# EAGLE board MIDI Decoder v1.0.0 (EAGLE 9.6.2), part 1 of 3
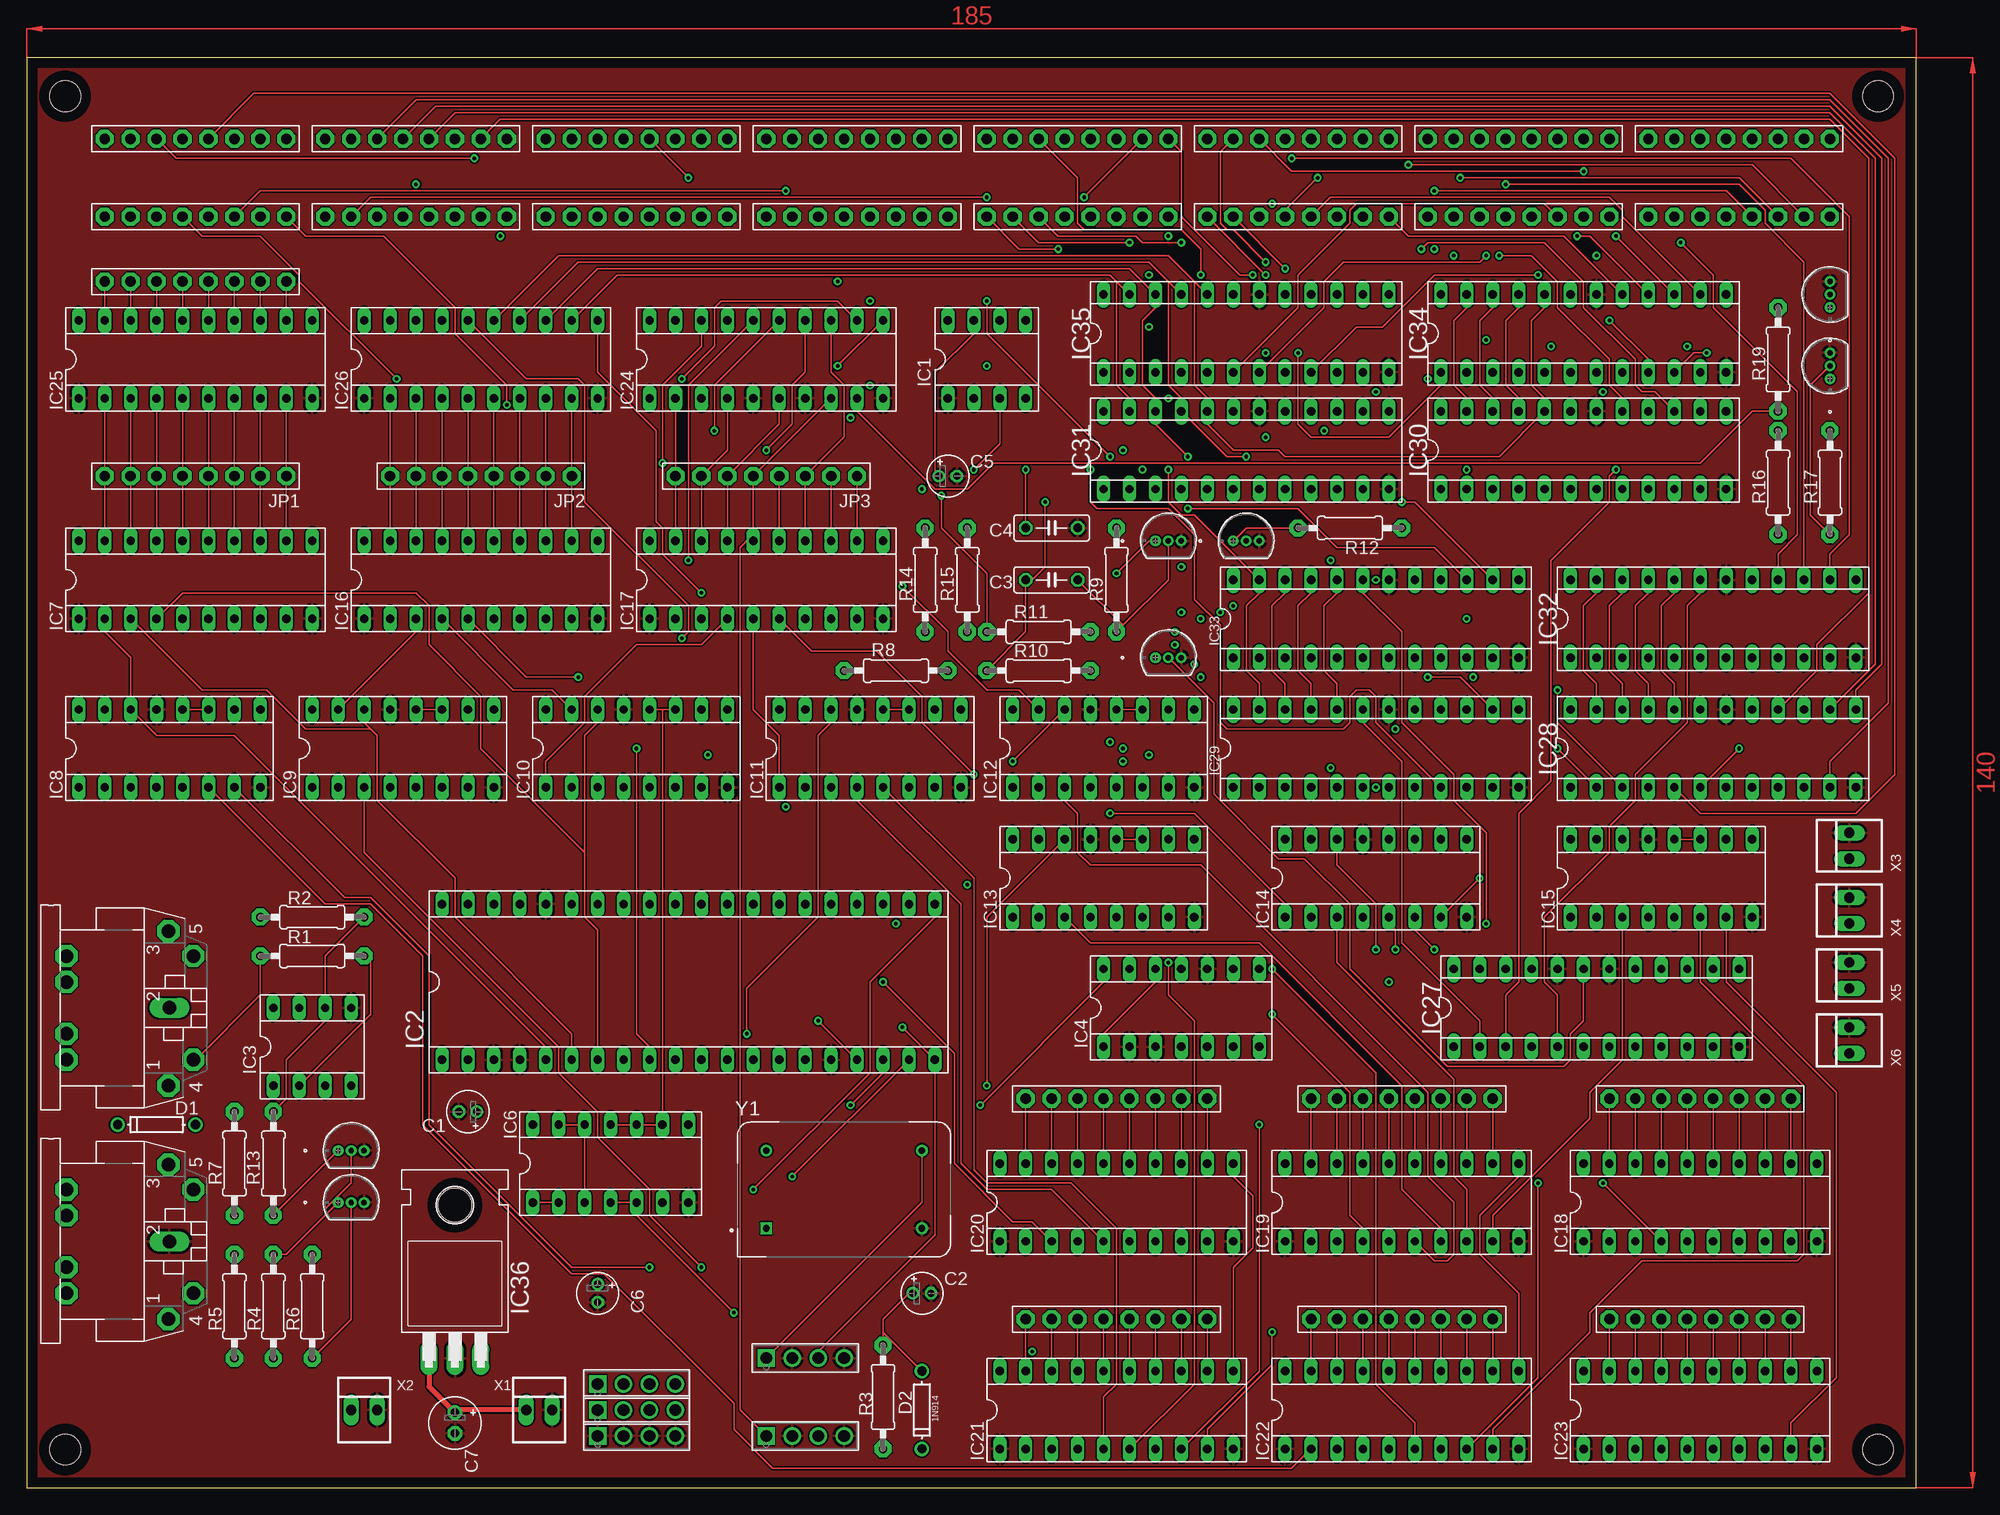
[diagram p2: board, top side]
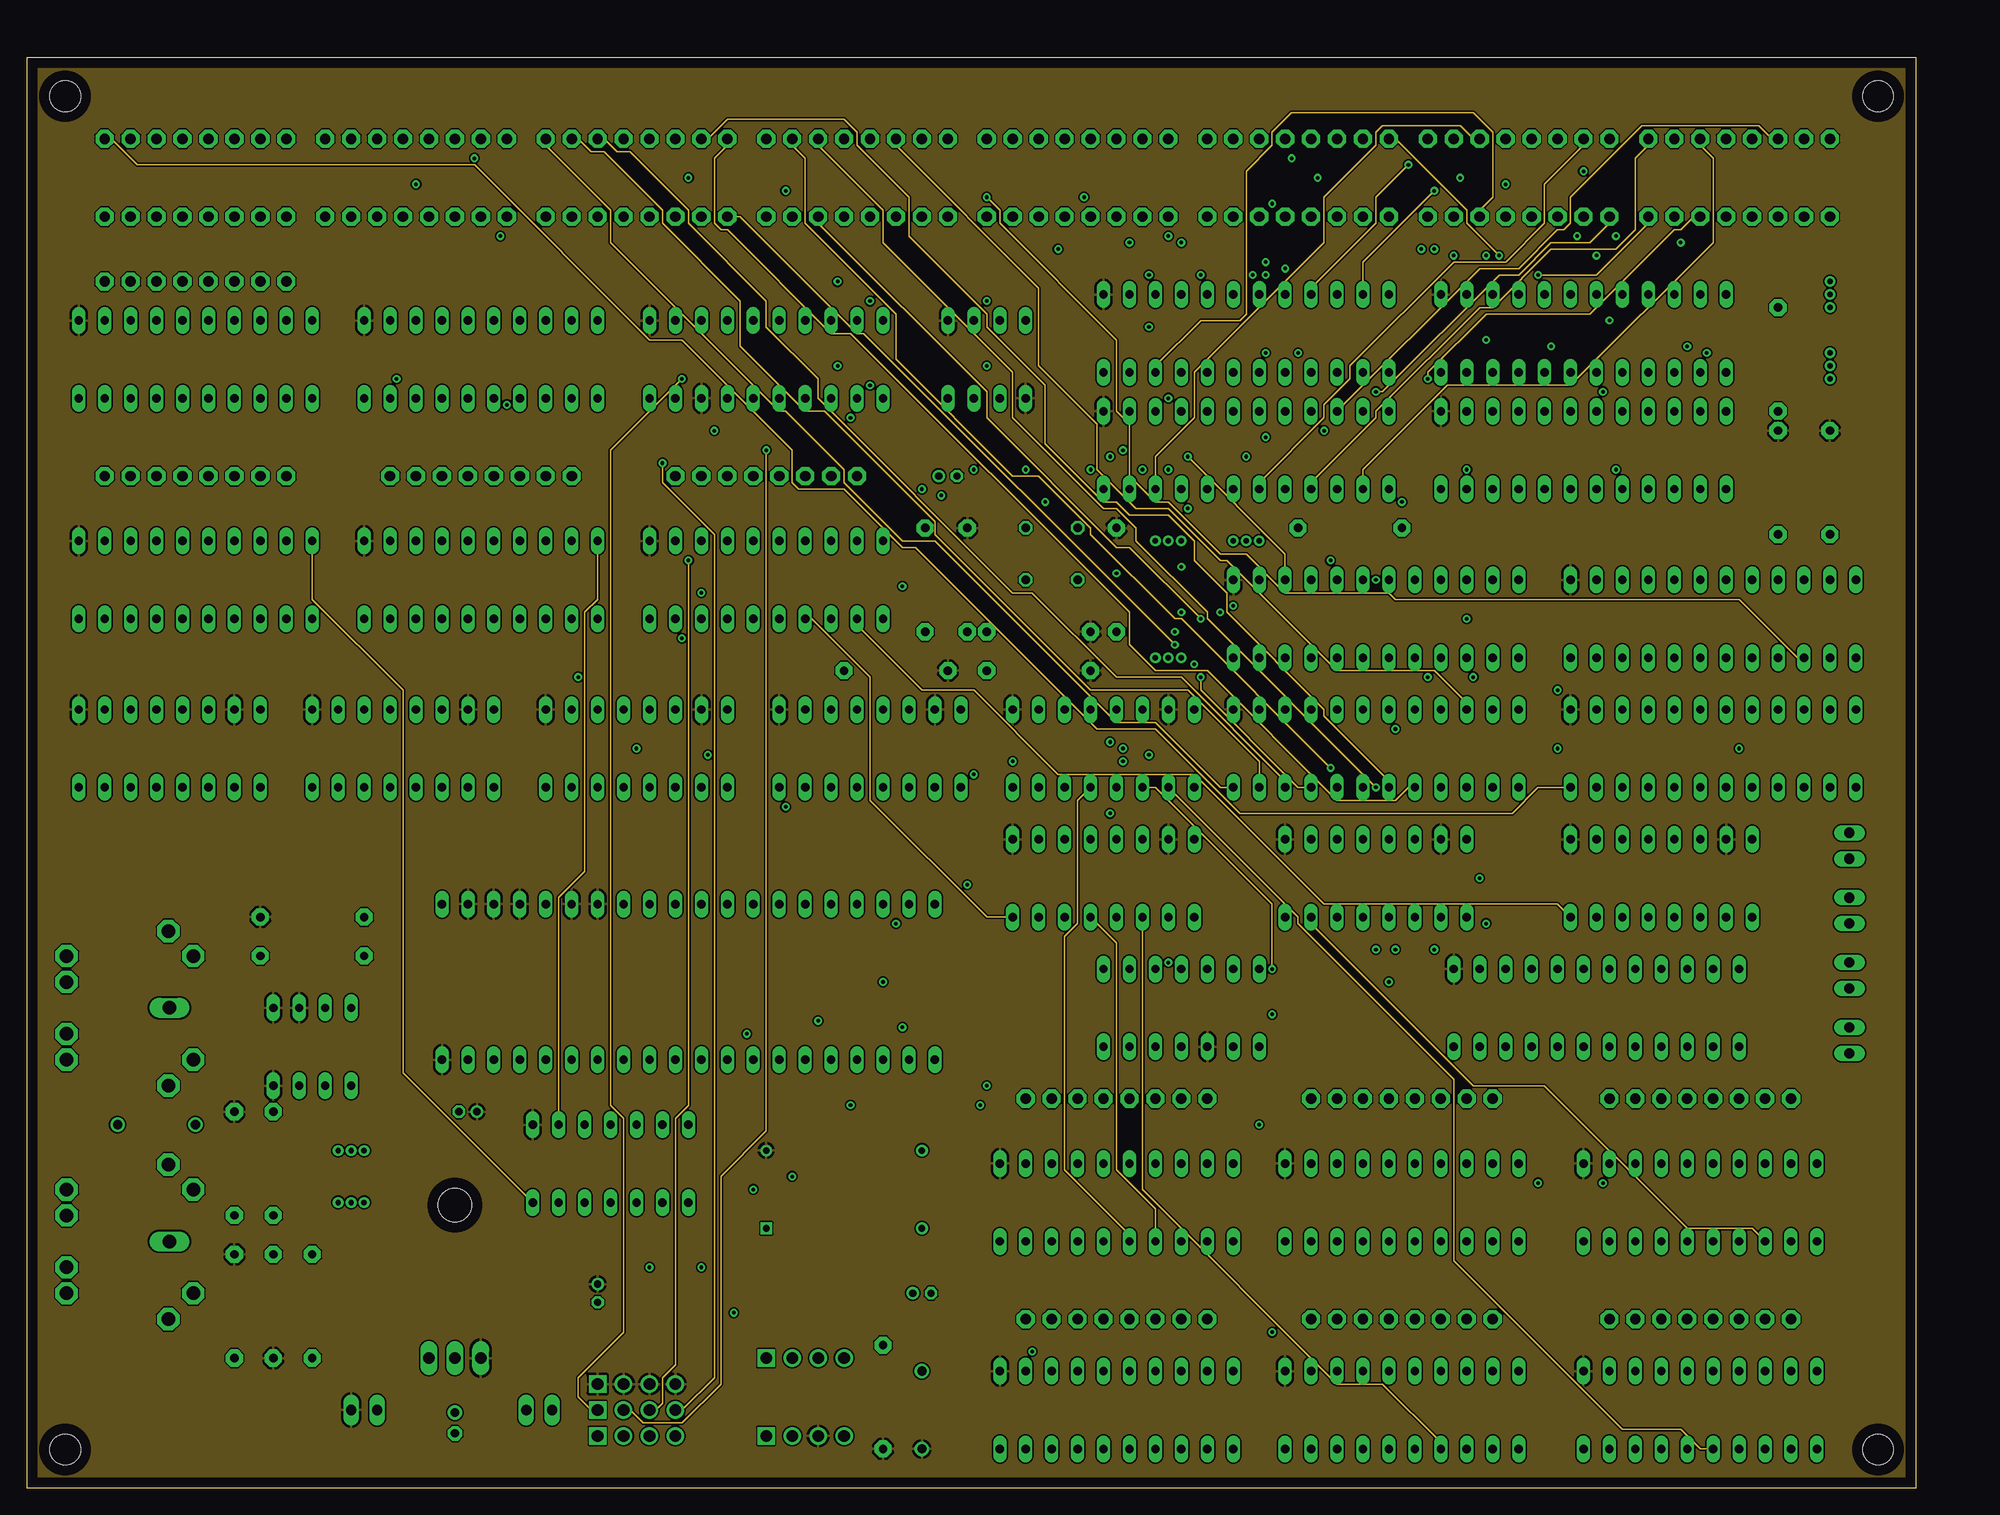
[diagram p3: board, inner layer Route2]
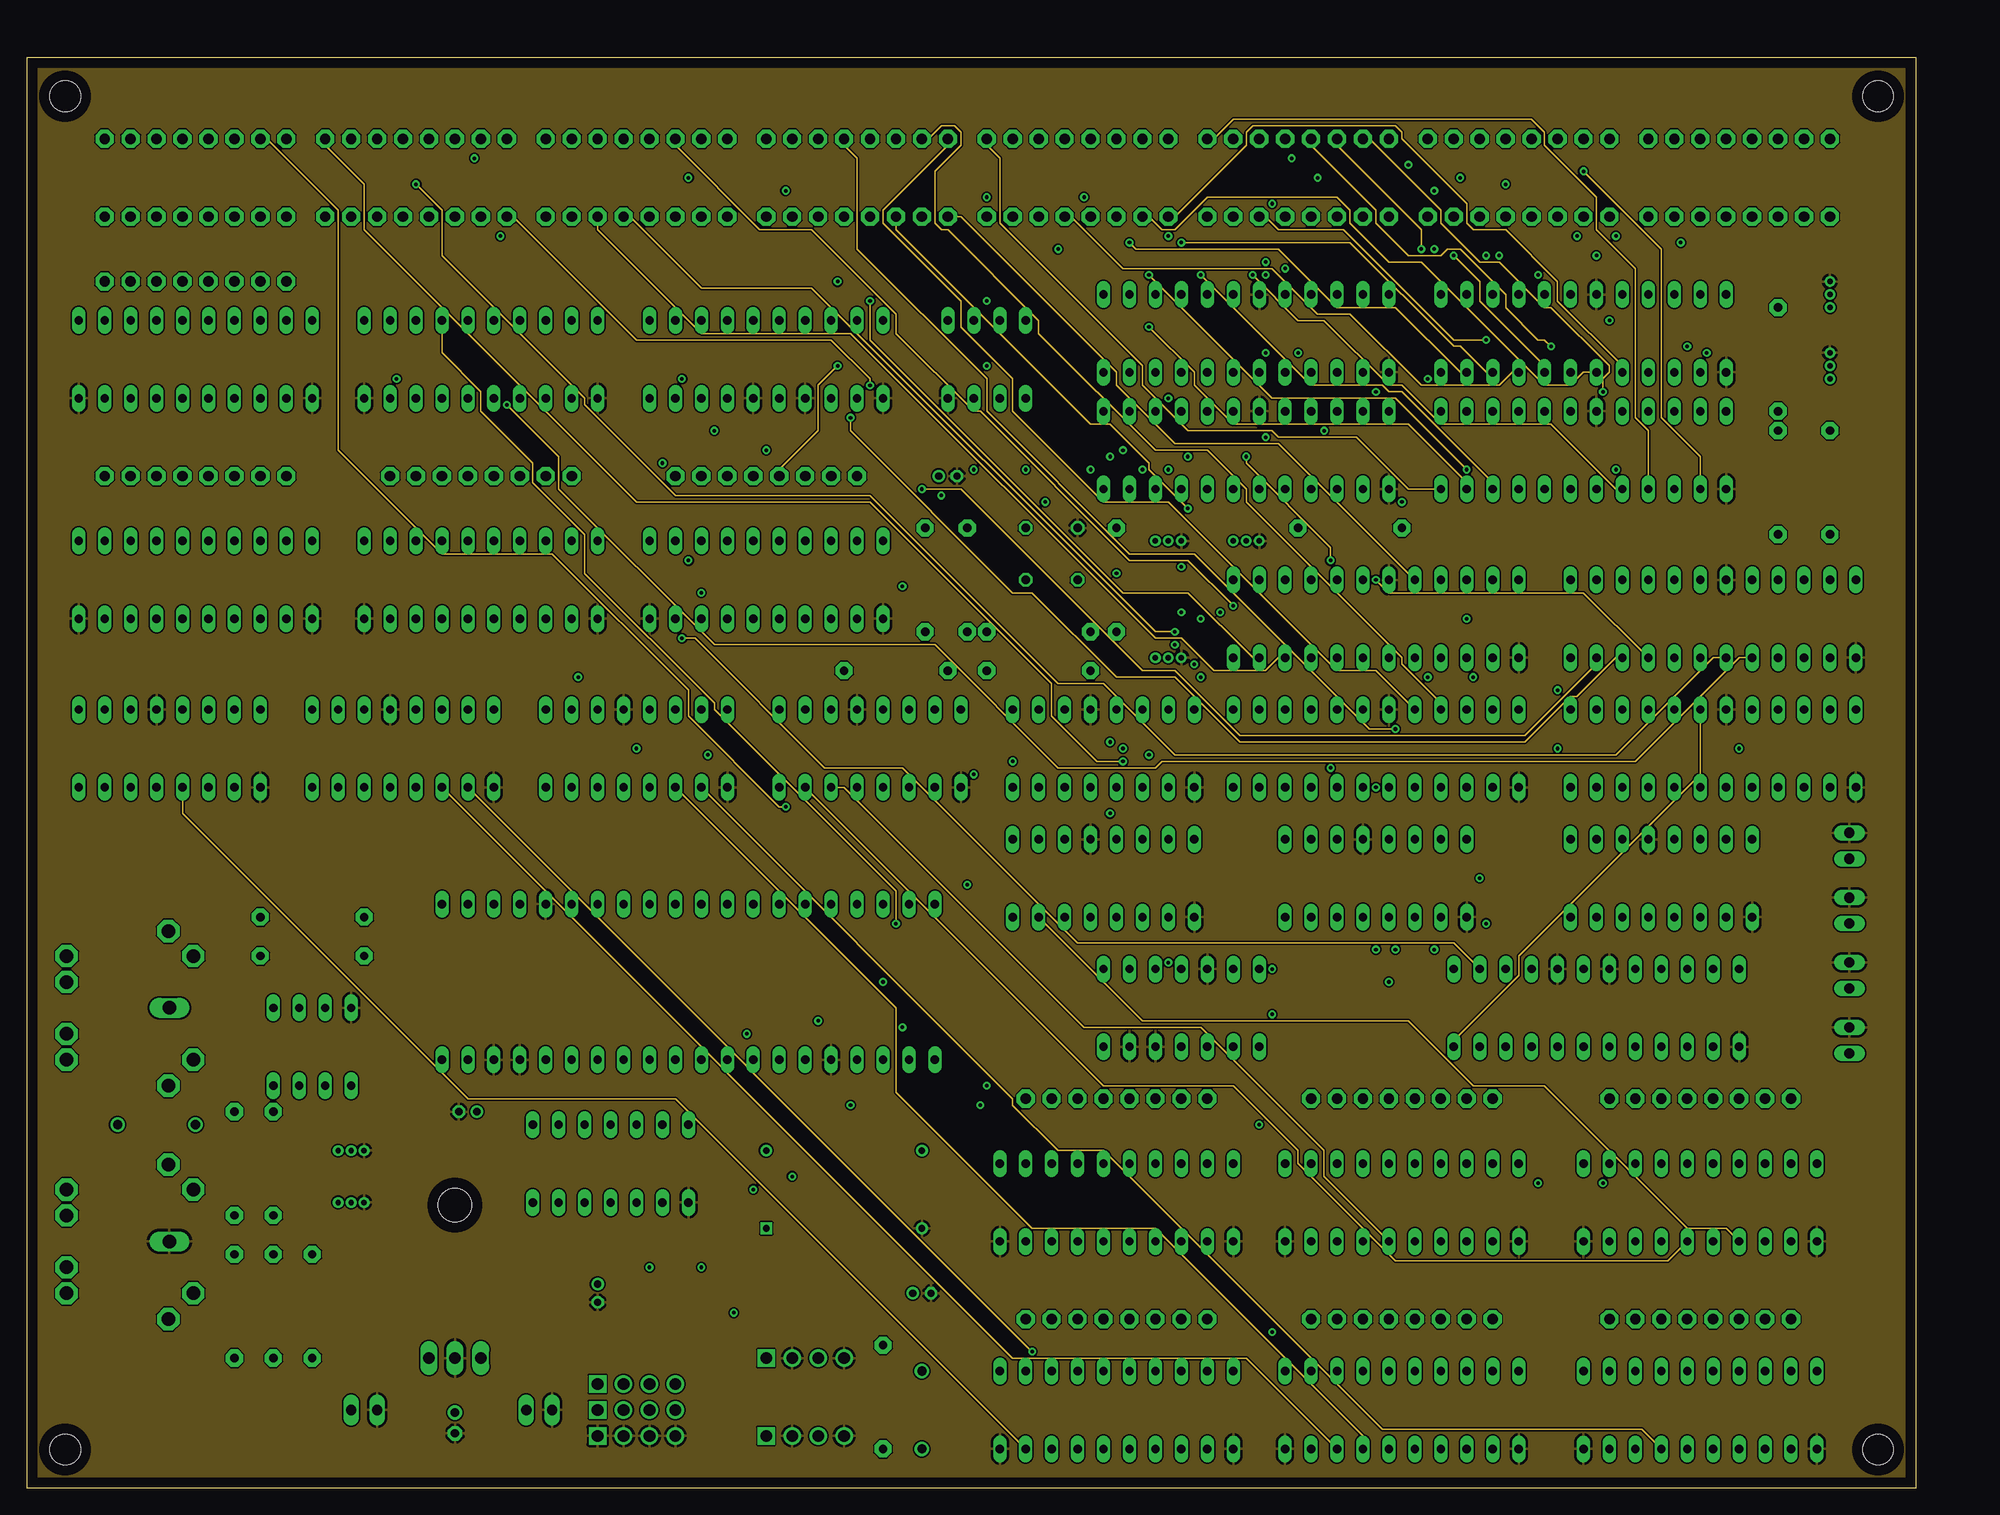
[diagram p4: board, inner layer Route3]
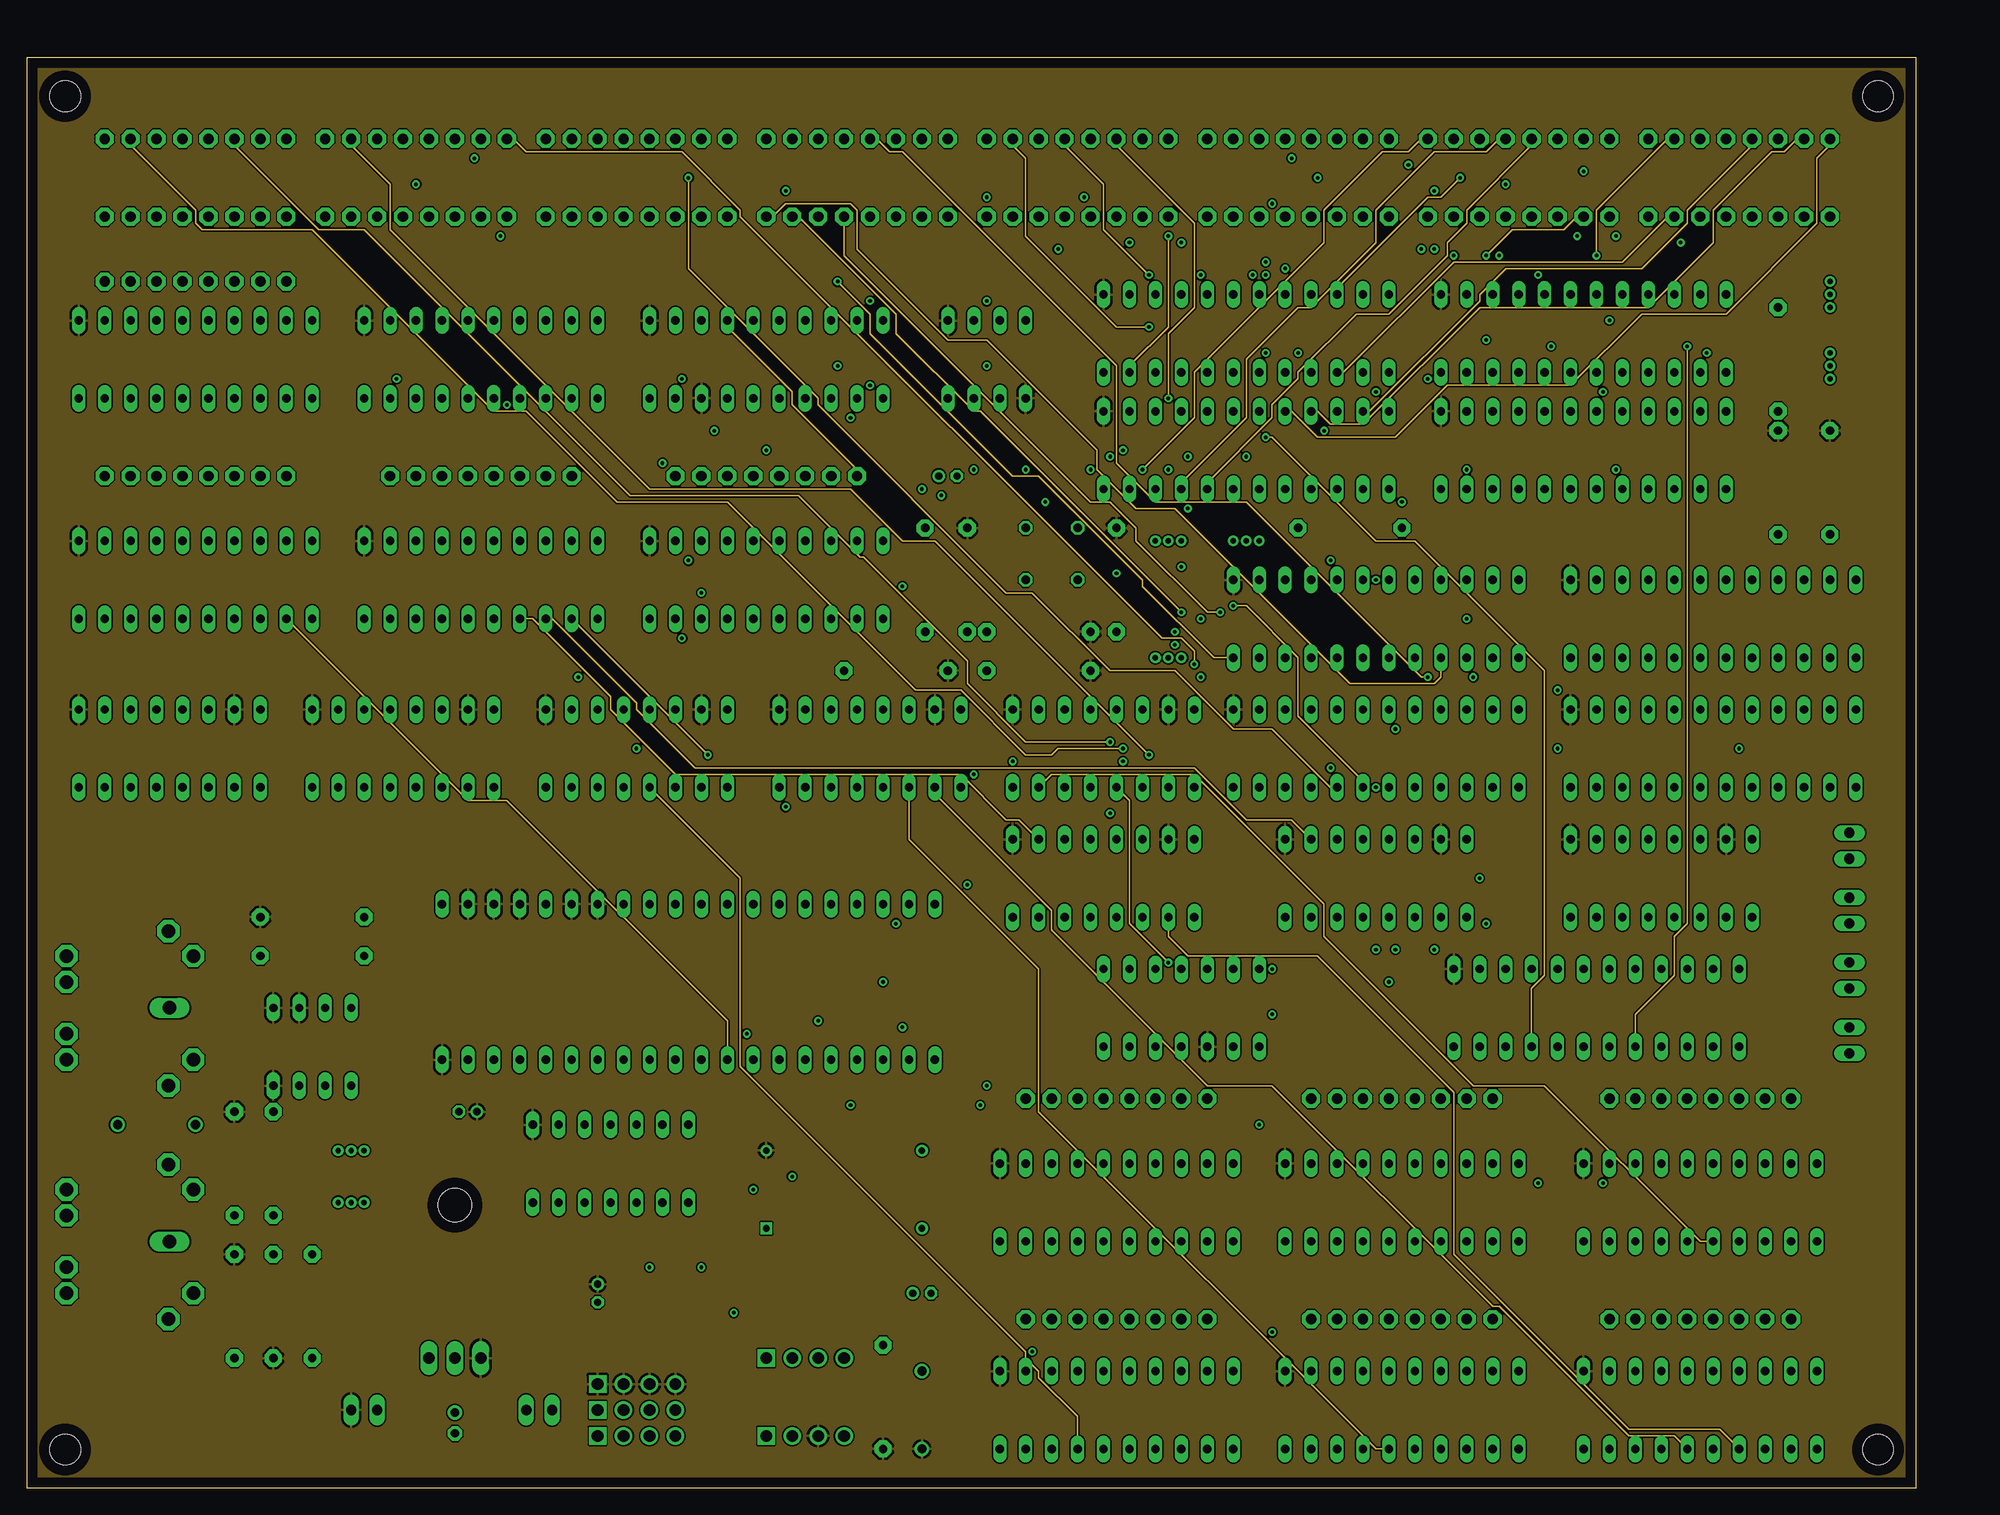
[diagram p5: board, inner layer Route14]
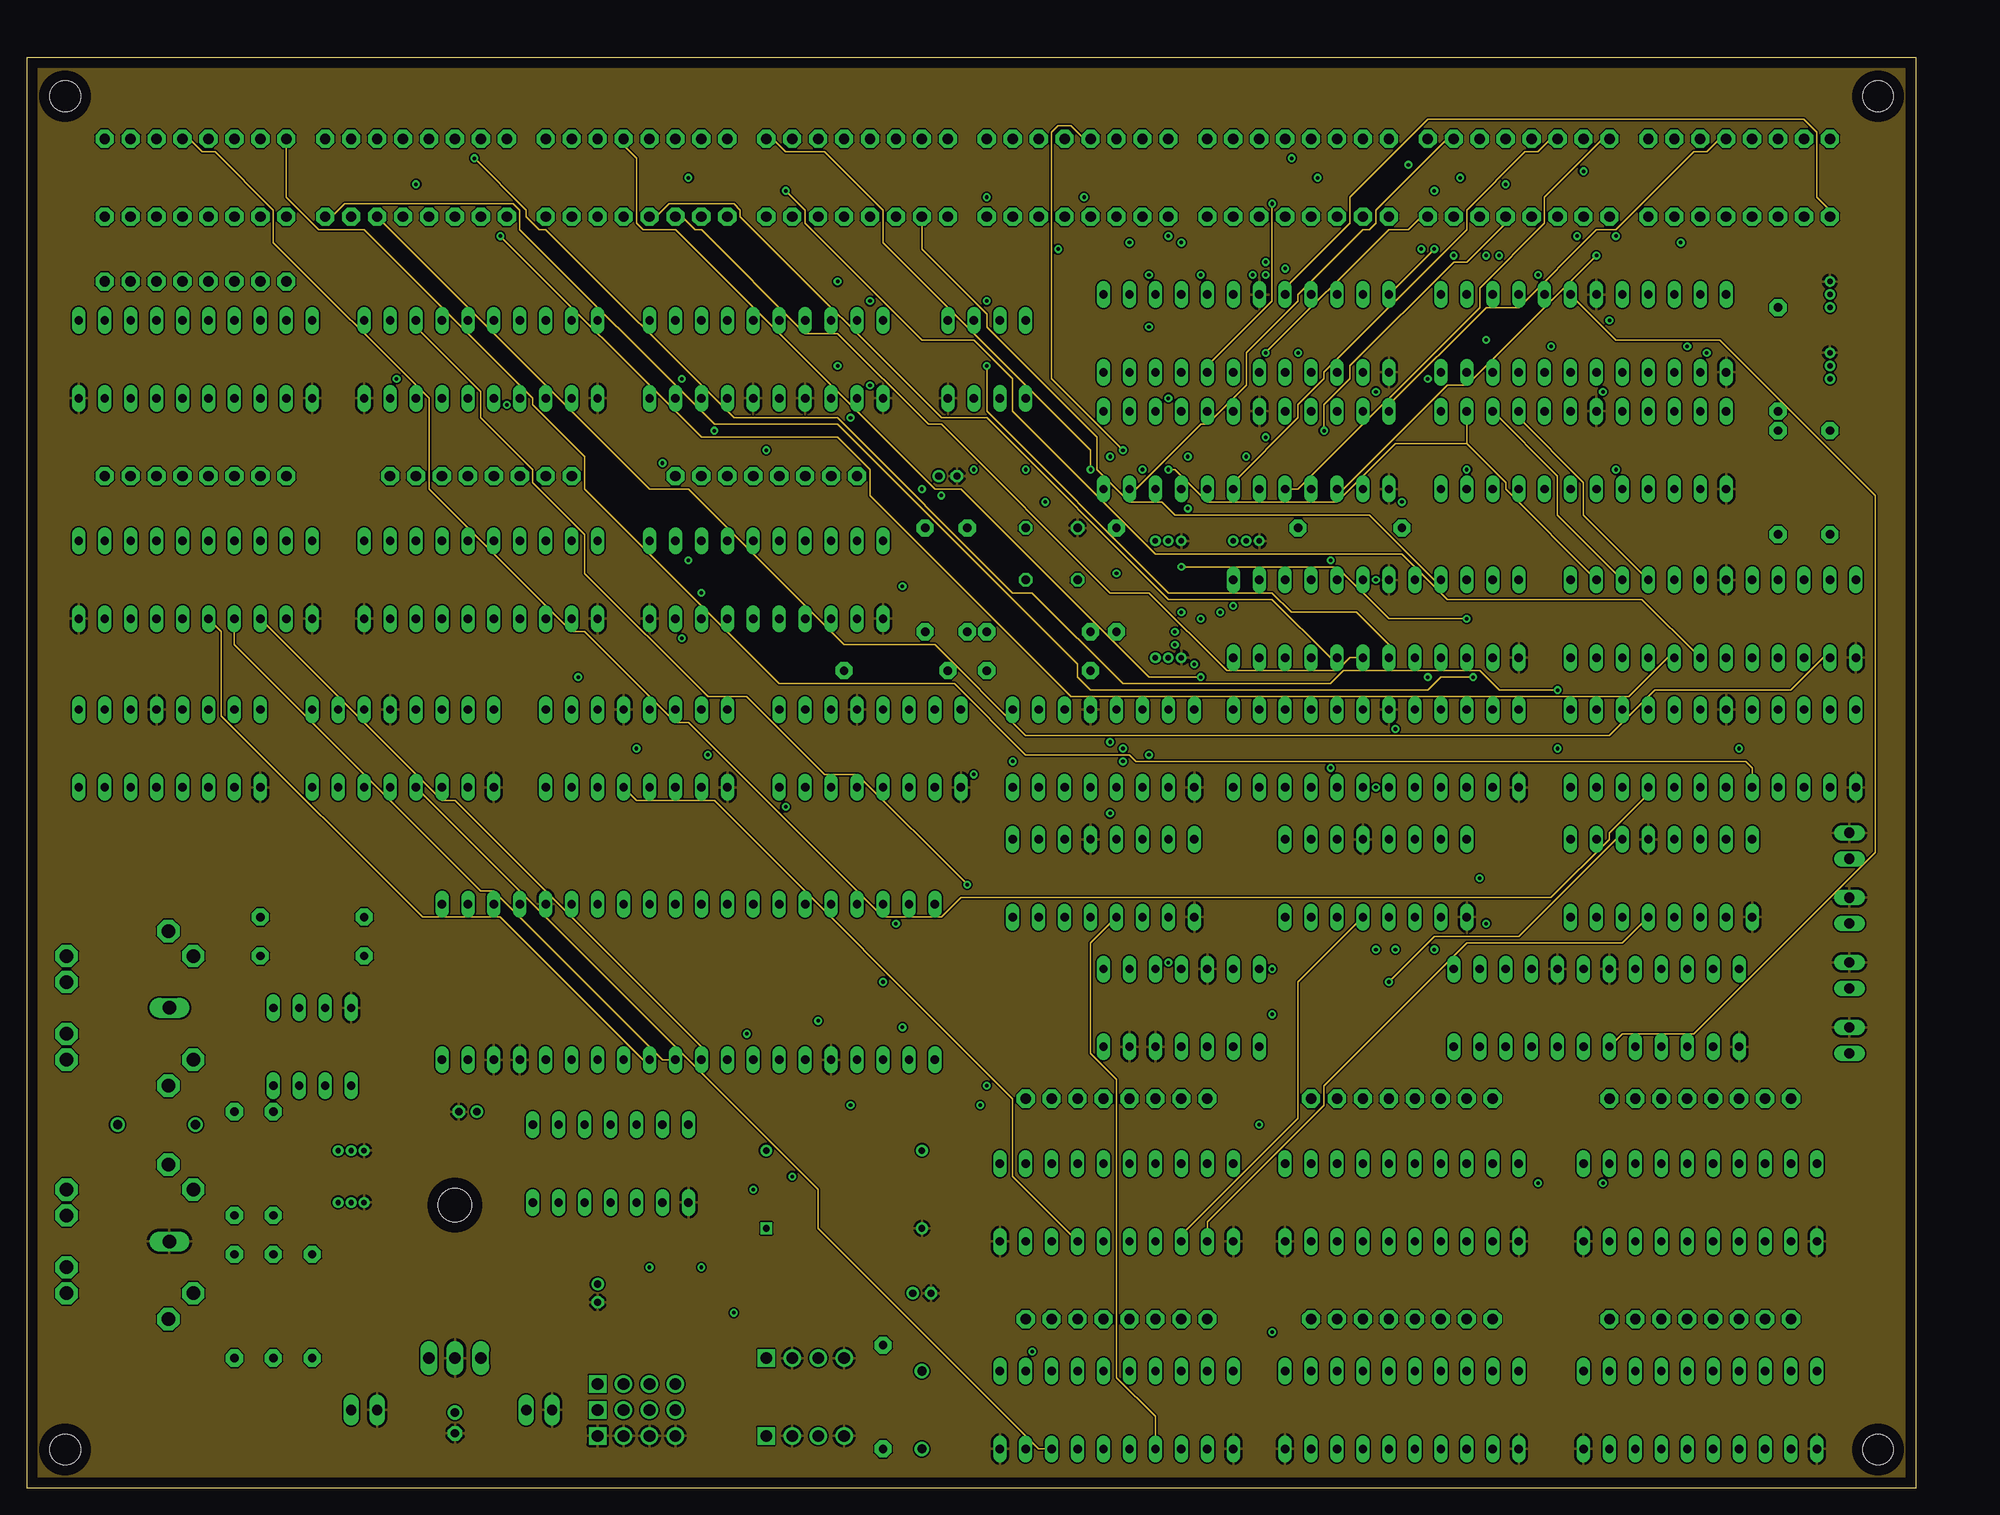
[diagram p6: board, inner layer Route15]
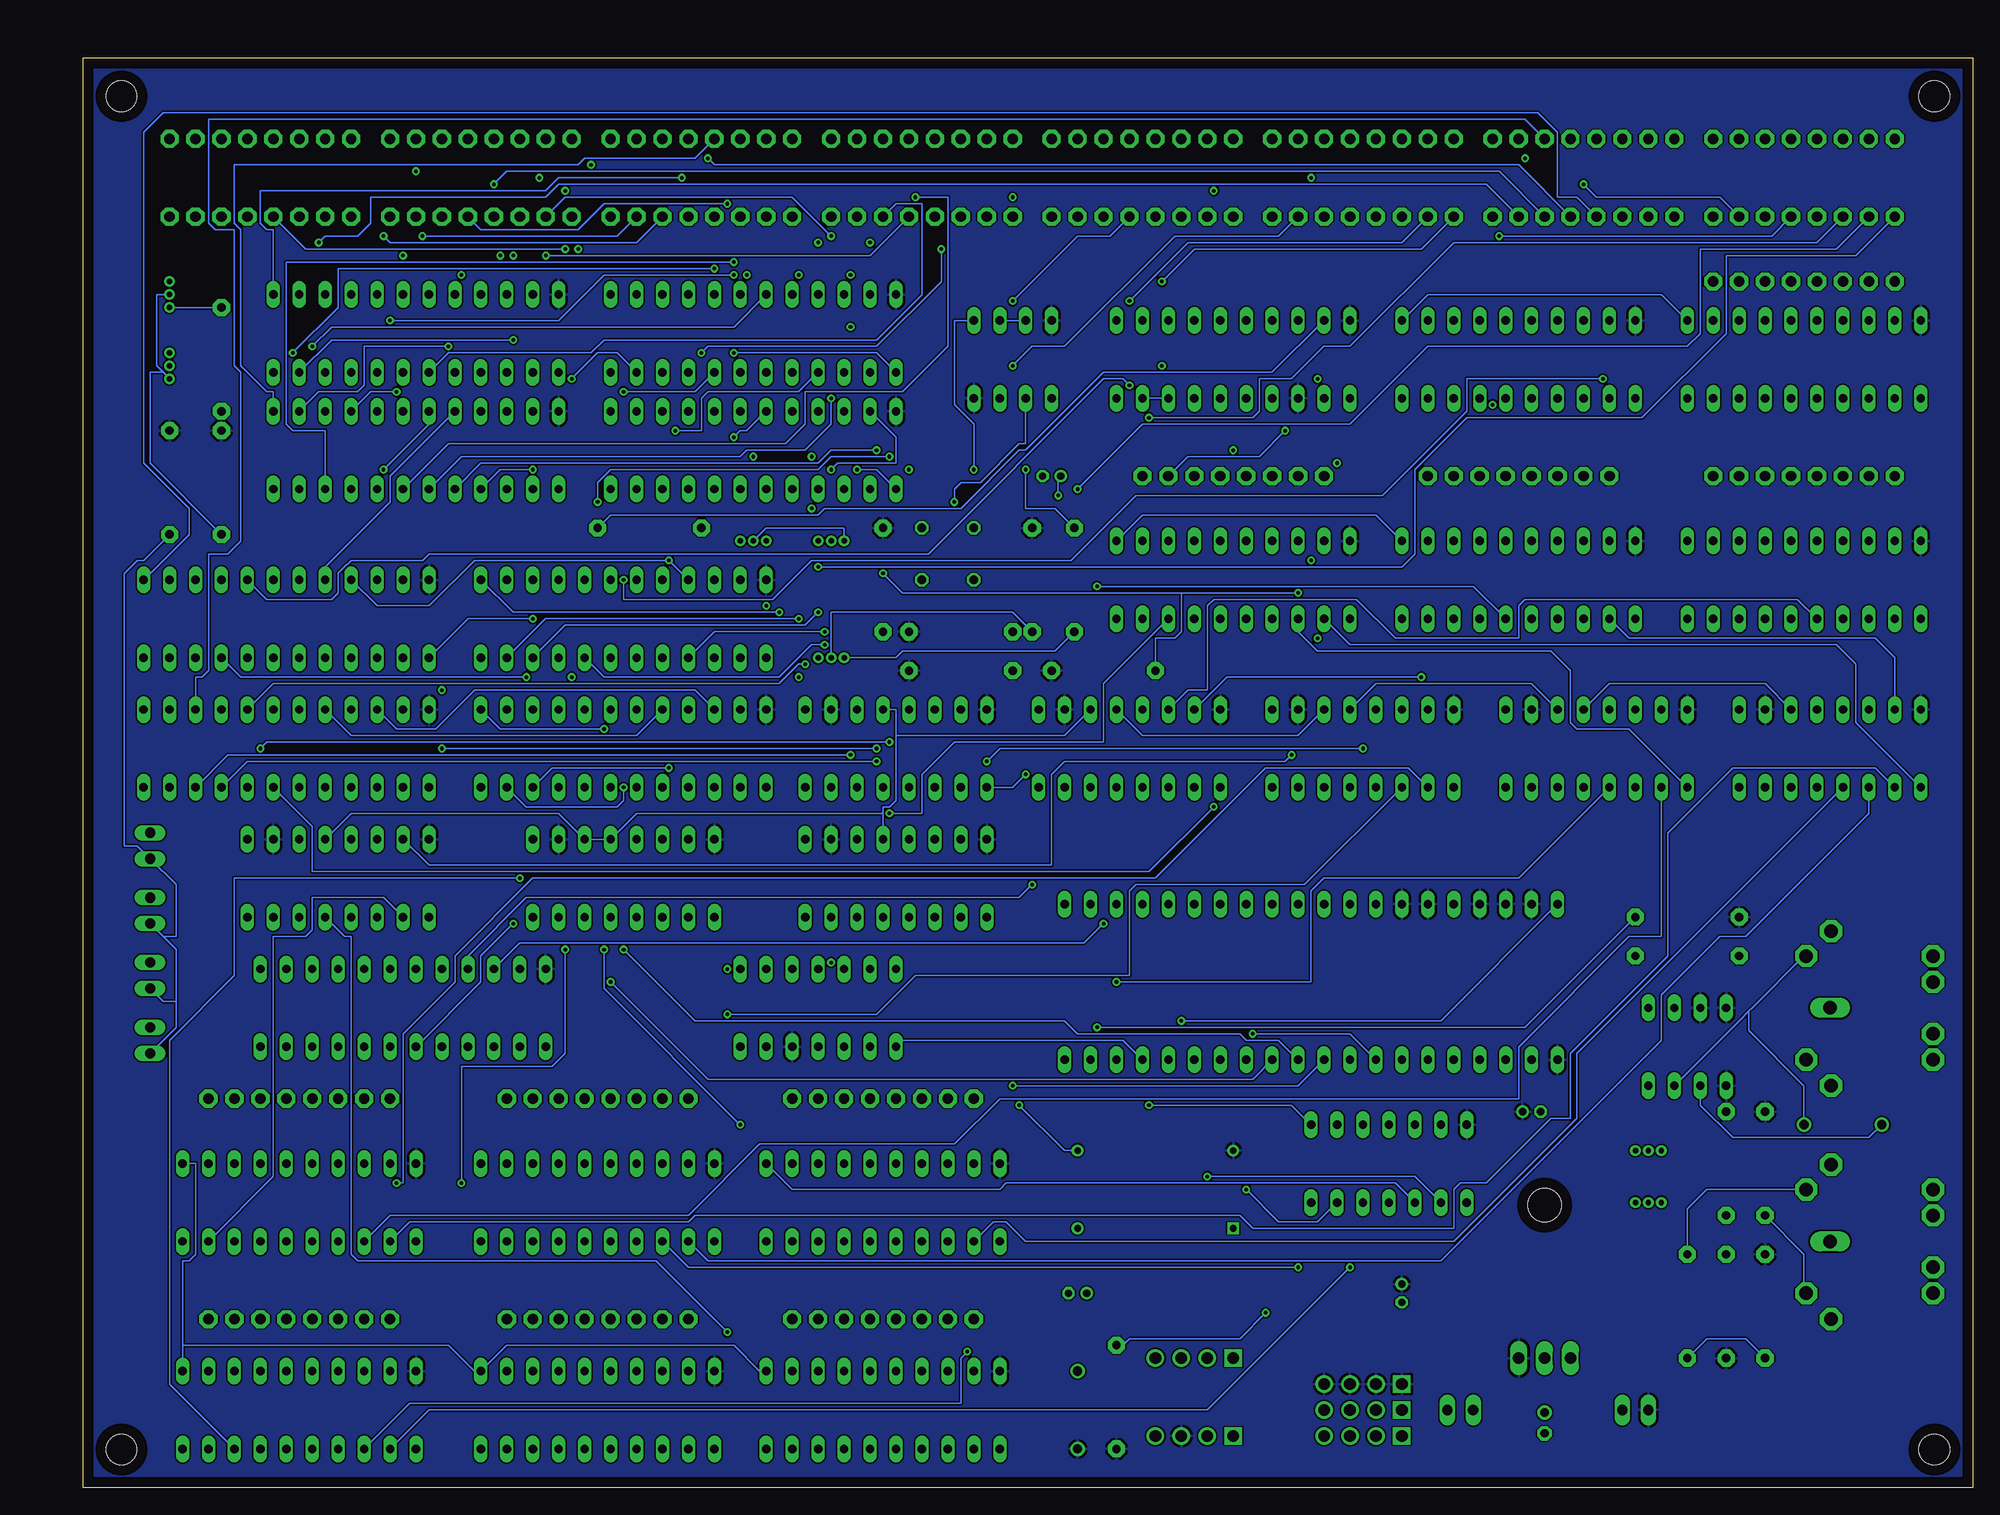
[diagram p7: board, bottom side, seen from below]

Size 185 x 140 mm. Coordinates in mm from the lower left corner, seen from the top.
Outline: 0,0 185,0 185,140 0,140 0,0
Copper layers (1+2*3+14*15+16): Top 0.035mm / dielectric 1.5mm / Route2 0.035mm / dielectric 0.15mm / Route3 0.035mm / dielectric 0.2mm / Route14 0.035mm / dielectric 0.15mm / Route15 0.035mm / dielectric 0.2mm / Bottom 0.035mm
Design rules "default *": minimum track width 6mil, minimum drill 0.35mm, track to track 6mil, track to pad 6mil, pad to pad 6mil, via to via 6mil, smd to smd 6mil, copper to edge 40mil, drill to drill 6mil, minimum pad ring 10mil, minimum via ring 8mil, stop-mask expansion 4mil, vias tented up to drill 0mil, thermal gap 10mil
Holes 3 mm at 181.25,136.25 181.25,3.75 3.75,3.75 3.75,136.25

## Footprints (pad centres in the part's own frame; a part is rotated, then mirrored left to right if it is on the bottom)
E1,8-4 = drill 0.711 pad 1.168: + -0.889,0 | drill 0.711 pad 1.168 octagon: - 0.889,0
C050-025X075 = drill 0.813 octagon: 1 -2.54,0; 2 2.54,0
E2-5 = drill 0.813 pad 1.422: + -1.016,0 | drill 0.813 pad 1.422 octagon: - 1.016,0
DO-1N4148 = drill 0.9: A -3.81,0; C 3.81,0
SOCKET-08 = drill 0.813 long: 1 -3.81,-3.81; 2 -1.27,-3.81; 3 1.27,-3.81; 4 3.81,-3.81; 5 3.81,3.81; 6 1.27,3.81; 7 -1.27,3.81; 8 -3.81,3.81
SOCKET-40 = drill 0.813 long: 1 -24.13,-7.62; 2 -21.59,-7.62; 3 -19.05,-7.62; 4 -16.51,-7.62; 5 -13.97,-7.62; 6 -11.43,-7.62; 7 -8.89,-7.62; 8 -6.35,-7.62; 9 -3.81,-7.62; 10 -1.27,-7.62; 11 1.27,-7.62; 12 3.81,-7.62; 13 6.35,-7.62; 14 8.89,-7.62; 15 11.43,-7.62; 16 13.97,-7.62; 17 16.51,-7.62; 18 19.05,-7.62; 19 21.59,-7.62; 20 24.13,-7.62; 21 24.13,7.62; 22 21.59,7.62; 23 19.05,7.62; 24 16.51,7.62; 25 13.97,7.62; 26 11.43,7.62; 27 8.89,7.62; 28 6.35,7.62; 29 3.81,7.62; 30 1.27,7.62; 31 -1.27,7.62; 32 -3.81,7.62; 33 -6.35,7.62; 34 -8.89,7.62; 35 -11.43,7.62; 36 -13.97,7.62; 37 -16.51,7.62; 38 -19.05,7.62; 39 -21.59,7.62; 40 -24.13,7.62
SOCKET-14 = drill 0.813 long: 1 -7.62,-3.81; 2 -5.08,-3.81; 3 -2.54,-3.81; 4 0,-3.81; 5 2.54,-3.81; 6 5.08,-3.81; 7 7.62,-3.81; 8 7.62,3.81; 9 5.08,3.81; 10 2.54,3.81; 11 0,3.81; 12 -2.54,3.81; 13 -5.08,3.81; 14 -7.62,3.81
SOCKET-20 = drill 0.813 long: 1 -11.43,-3.81; 2 -8.89,-3.81; 3 -6.35,-3.81; 4 -3.81,-3.81; 5 -1.27,-3.81; 6 1.27,-3.81; 7 3.81,-3.81; 8 6.35,-3.81; 9 8.89,-3.81; 10 11.43,-3.81; 11 11.43,3.81; 12 8.89,3.81; 13 6.35,3.81; 14 3.81,3.81; 15 1.27,3.81; 16 -1.27,3.81; 17 -3.81,3.81; 18 -6.35,3.81; 19 -8.89,3.81; 20 -11.43,3.81
SOCKET-16 = drill 0.813 long: 1 -8.89,-3.81; 2 -6.35,-3.81; 3 -3.81,-3.81; 4 -1.27,-3.81; 5 1.27,-3.81; 6 3.81,-3.81; 7 6.35,-3.81; 8 8.89,-3.81; 9 8.89,3.81; 10 6.35,3.81; 11 3.81,3.81; 12 1.27,3.81; 13 -1.27,3.81; 14 -3.81,3.81; 15 -6.35,3.81; 16 -8.89,3.81
SOCKET-24S = drill 0.813 long: 1 -13.97,-3.81; 2 -11.43,-3.81; 3 -8.89,-3.81; 4 -6.35,-3.81; 5 -3.81,-3.81; 6 -1.27,-3.81; 7 1.27,-3.81; 8 3.81,-3.81; 9 6.35,-3.81; 10 8.89,-3.81; 11 11.43,-3.81; 12 13.97,-3.81; 13 13.97,3.81; 14 11.43,3.81; 15 8.89,3.81; 16 6.35,3.81; 17 3.81,3.81; 18 1.27,3.81; 19 -1.27,3.81; 20 -3.81,3.81; 21 -6.35,3.81; 22 -8.89,3.81; 23 -11.43,3.81; 24 -13.97,3.81
TO220H = drill 1.118 long: 1 -2.54,-10.16; 2 0,-10.16; 3 2.54,-10.16 | hole 3.302: 0,4.826
CONN_61300411121_WRE = drill 1.143 pad 1.651 square: 1 0,0 | drill 1.143 pad 1.651: 2 2.54,0; 3 5.08,0; 4 7.62,0
1X08-BIG = drill 1.016 pad 1.778 octagon: 1 -8.89,0; 2 -6.35,0; 3 -3.81,0; 4 -1.27,0; 5 1.27,0; 6 3.81,0; 7 6.35,0; 8 8.89,0
0207/10 = drill 0.813 pad 1.676 octagon: 1 -5.08,0; 2 5.08,0
TO_SA06_ONS = drill 0.533 pad 1.041: 1 0,0; 2 1.27,0; 3 2.54,0
CP-2350 = drill 1.321 pad 2.184 octagon: 1 7.62,12.58; 3 -7.52,12.58; 4 5.08,15.02; 5 -5.08,15.02; PE -2.54,2.62; PE1 -5.08,2.62; PE2 5.08,2.62; PE@ 2.54,2.62 | drill 1.321 long: 2 0,12.68
22-23-2021 = drill 1 long: 1 -1.27,0; 2 1.27,0
OSC_ECS-100A-010 = drill 0.65 square: 1 -7.62,-3.81 | drill 0.65: 7 7.62,-3.81; 8 7.62,3.81; 14 -7.62,3.81

## Placement (x,y rotation side)
C1  100nF  [E1,8-4]  43.18,36.83 180 top
C2  100nF  [E1,8-4]  87.63,19.05 0 top
C3  10nF  [C050-025X075]  100.33,88.9 0 top
C4  10nF  [C050-025X075]  100.33,93.98 0 top
C5  100nF  [E1,8-4]  90.17,99.06 0 top
C6  100nF  [E1,8-4]  55.88,19.05 270 top
C7  220nF  [E2-5]  41.91,6.35 270 top
D1  [DO-1N4148]  12.7,35.56 180 top
D2  1N914  [DO-1N4148]  87.63,7.62 270 top
IC1  555  [SOCKET-08]  93.98,110.49 0 top
IC2  6402 UART  [SOCKET-40]  64.77,49.53 0 top
IC3  6N137  [SOCKET-08]  27.94,43.18 0 top
IC4  SN74HC93  [SOCKET-14]  113.03,46.99 0 top
IC6  SN74LS132  [SOCKET-14]  57.15,31.75 0 top
IC7  74HC574  [SOCKET-20]  16.51,88.9 0 top
IC8  SN74HC574  [SOCKET-16]  13.97,72.39 0 top
IC9  SN74HC574  [SOCKET-16]  36.83,72.39 0 top
IC10  SN74HC574  [SOCKET-16]  59.69,72.39 0 top
IC11  SN74HC574  [SOCKET-16]  82.55,72.39 0 top
IC12  SN74HC574  [SOCKET-16]  105.41,72.39 0 top
IC13  SN74HC574  [SOCKET-16]  105.41,59.69 0 top
IC14  SN74HC574  [SOCKET-16]  132.08,59.69 0 top
IC15  SN74HC574  [SOCKET-16]  160.02,59.69 0 top
IC16  74HC574  [SOCKET-20]  44.45,88.9 0 top
IC17  74HC574  [SOCKET-20]  72.39,88.9 0 top
IC18  74HC574  [SOCKET-20]  163.83,27.94 0 top
IC19  74HC574  [SOCKET-20]  134.62,27.94 0 top
IC20  74HC574  [SOCKET-20]  106.68,27.94 0 top
IC21  74HC574  [SOCKET-20]  106.68,7.62 0 top
IC22  74HC574  [SOCKET-20]  134.62,7.62 0 top
IC23  74HC574  [SOCKET-20]  163.83,7.62 0 top
IC24  74HC682  [SOCKET-20]  72.39,110.49 0 top
IC25  74HC574  [SOCKET-20]  16.51,110.49 0 top
IC26  74HC574  [SOCKET-20]  44.45,110.49 0 top
IC27  74HC154EN  [SOCKET-24S]  153.67,46.99 0 top
IC28  74HC154EN  [SOCKET-24S]  165.1,72.39 0 top
IC29  74HC154EN  [SOCKET-24S]  132.08,72.39 0 top
IC30  74HC154EN  [SOCKET-24S]  152.4,101.6 0 top
IC31  74HC154EN  [SOCKET-24S]  119.38,101.6 0 top
IC32  74HC154EN  [SOCKET-24S]  165.1,85.09 0 top
IC33  74HC154EN  [SOCKET-24S]  132.08,85.09 0 top
IC34  74HC154EN  [SOCKET-24S]  152.4,113.03 0 top
IC35  74HC154EN  [SOCKET-24S]  119.38,113.03 0 top
IC36  LM340H-05  [TO220H]  41.91,22.86 0 top
J1  61300411121  [CONN_61300411121_WRE]  55.88,7.62 0 top
J2  61300411121  [CONN_61300411121_WRE]  55.88,10.16 0 top
J3  61300411121  [CONN_61300411121_WRE]  55.88,5.08 0 top
J4  61300411121  [CONN_61300411121_WRE]  72.39,5.08 0 top
J5  61300411121  [CONN_61300411121_WRE]  72.39,12.7 0 top
JP1  Byte 0  [1X08-BIG]  16.51,99.06 180 top
JP2  Byte 1  [1X08-BIG]  44.45,99.06 180 top
JP3  Byte 2  [1X08-BIG]  72.39,99.06 180 top
JP4  Byte 3  [1X08-BIG]  163.83,38.1 180 top
JP5  Byte 4  [1X08-BIG]  134.62,38.1 180 top
JP6  Byte 5  [1X08-BIG]  106.68,38.1 180 top
JP7  Byte 6  [1X08-BIG]  106.68,16.51 180 top
JP8  Byte 7  [1X08-BIG]  134.62,16.51 180 top
JP9  Byte 8  [1X08-BIG]  163.83,16.51 180 top
JP10  Velocity  [1X08-BIG]  16.51,118.11 180 top
JP11  C-1 to G-1  [1X08-BIG]  16.51,132.08 0 top
JP12  G#-1 to D#0  [1X08-BIG]  38.1,132.08 0 top
JP13  E0 to B0  [1X08-BIG]  59.69,132.08 0 top
JP14  C1 to G1  [1X08-BIG]  81.28,132.08 0 top
JP15  G#1 to D#2  [1X08-BIG]  102.87,132.08 0 top
JP16  E2 to B2  [1X08-BIG]  124.46,132.08 0 top
JP17  C3 to G3  [1X08-BIG]  146.05,132.08 0 top
JP18  G#3 to D#4  [1X08-BIG]  167.64,132.08 0 top
JP19  E4 to B4  [1X08-BIG]  16.51,124.46 0 top
JP20  C5 to G5  [1X08-BIG]  38.1,124.46 0 top
JP21  G#5 to D#6  [1X08-BIG]  59.69,124.46 0 top
JP22  E6 to B6  [1X08-BIG]  81.28,124.46 0 top
JP23  C7 to G7  [1X08-BIG]  102.87,124.46 0 top
JP24  G#7 to D#8  [1X08-BIG]  124.46,124.46 0 top
JP25  E8 to B8  [1X08-BIG]  146.05,124.46 0 top
JP26  C9 to G9  [1X08-BIG]  167.64,124.46 0 top
R1  220Ω  [0207/10]  27.94,52.07 0 top
R2  1kΩ  [0207/10]  27.94,55.88 180 top
R3  22kΩ  [0207/10]  83.82,8.89 270 top
R4  1kΩ  [0207/10]  24.13,17.78 270 top
R5  1kΩ  [0207/10]  20.32,17.78 90 top
R6  220Ω  [0207/10]  27.94,17.78 90 top
R7  220Ω  [0207/10]  20.32,31.75 90 top
R8  1kΩ  [0207/10]  85.09,80.01 0 top
R9  1kΩ  [0207/10]  106.68,88.9 90 top
R10  220Ω  [0207/10]  99.06,80.01 0 top
R11  220Ω  [0207/10]  99.06,83.82 0 top
R12  220Ω  [0207/10]  129.54,93.98 180 top
R13  220Ω  [0207/10]  24.13,31.75 90 top
R14  220Ω  [0207/10]  87.95,88.9 90 top
R15  1kΩ  [0207/10]  92.08,88.9 90 top
R16  1kΩ  [0207/10]  171.45,98.42 90 top
R17  1kΩ  [0207/10]  176.53,98.42 90 top
R19  220Ω  [0207/10]  171.45,110.49 90 top
U1  BS170  [TO_SA06_ONS]  30.48,33.02 0 top
U2  BS170  [TO_SA06_ONS]  30.48,27.94 0 top
U3  BS170  [TO_SA06_ONS]  118.11,92.71 0 top
U4  BS170  [TO_SA06_ONS]  110.49,92.71 0 top
U5  BS170  [TO_SA06_ONS]  110.49,81.28 0 top
U6  BS170  [TO_SA06_ONS]  176.53,115.57 90 top
U7  BS170  [TO_SA06_ONS]  176.53,108.58 90 top
U$1  MIDIJACK  [CP-2350]  1.27,46.99 270 top
U$2  MIDIJACK  [CP-2350]  1.27,24.13 270 top
X1  22-23-2021  [22-23-2021]  50.16,7.62 0 top
X2  22-23-2021  [22-23-2021]  33.02,7.62 0 top
X3  22-23-2021  [22-23-2021]  178.44,62.87 90 top
X4  22-23-2021  [22-23-2021]  178.44,56.52 90 top
X5  22-23-2021  [22-23-2021]  178.44,50.16 90 top
X6  22-23-2021  [22-23-2021]  178.44,43.81 90 top
Y1  ECS-100A-010  [OSC_ECS-100A-010]  80.01,29.21 0 top